# Altium schematic sheet Dash22_LEDS.SchDoc
size A
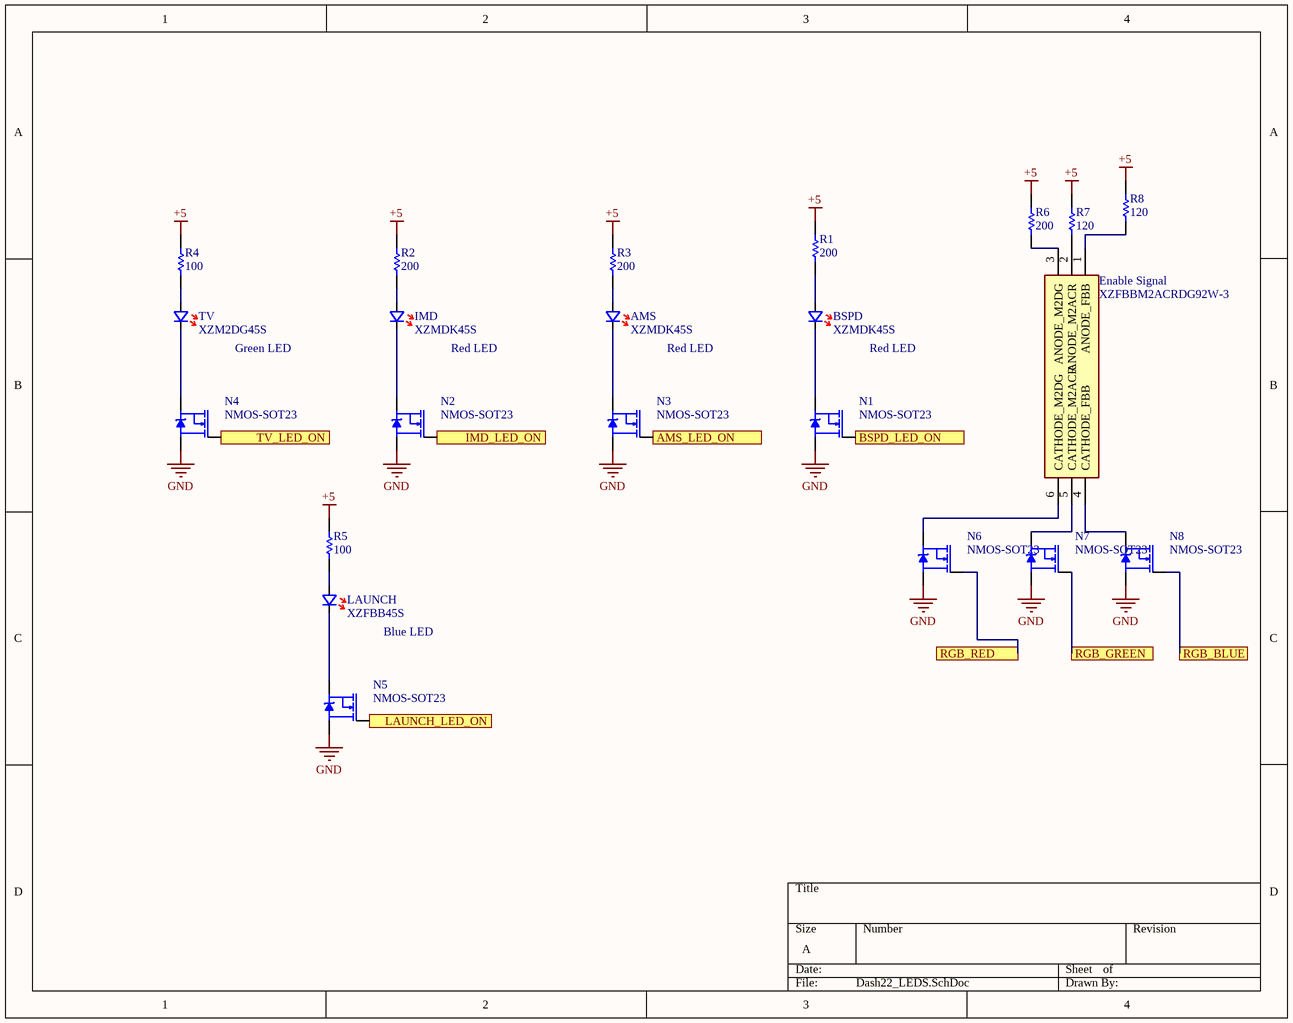
[diagram p0: Dash22_LEDS.SchDoc]

## Parts
AMS  XZMDK45S  [LED_XZFBB45S]
BSPD  XZMDK45S  [LED_XZFBB45S]
Enable_Signal  XZFBBM2ACRDG92W-3  [XZFBBM2ACRDG92W3]
IMD  XZMDK45S  [LED_XZFBB45S]
LAUNCH  XZFBB45S  [LED_XZFBB45S]
N1  NMOS-SOT23  [SOT23]
N2  NMOS-SOT23  [SOT23]
N3  NMOS-SOT23  [SOT23]
N4  NMOS-SOT23  [SOT23]
N5  NMOS-SOT23  [SOT23]
N6  NMOS-SOT23  [SOT23]
N7  NMOS-SOT23  [SOT23]
N8  NMOS-SOT23  [SOT23]
R1  200  [RESC1608X55X25ML10T15]
R2  200  [RESC1608X55X25ML10T15]
R3  200  [RESC1608X55X25ML10T15]
R4  100  [RESC1608X55X25ML10T15]
R5  100  [RESC1608X55X25ML10T15]
R6  200  [RESC1608X55X25ML10T15]
R7  120  [RESC1608X55X25ML10T15]
R8  120  [RESC1608X55X25ML10T15]
TV  XZM2DG45S  [LED_XZFBB45S]

## Ports
AMS_LED_ON, BSPD_LED_ON, IMD_LED_ON, LAUNCH_LED_ON, RGB_BLUE, RGB_GREEN, RGB_RED, TV_LED_ON

## Nets
+5: R1.2 R2.2 R3.2 R4.2 R5.2 R6.2 R7.2 R8.2
GND: N1.2(S) N2.2(S) N3.2(S) N4.2(S) N5.2(S) N6.2(S) N7.2(S) N8.2(S)
AMS_LED_ON: N3.1(G) ; port AMS_LED_ON
BSPD_LED_ON: N1.1(G) ; port BSPD_LED_ON
IMD_LED_ON: N2.1(G) ; port IMD_LED_ON
LAUNCH_LED_ON: N5.1(G) ; port LAUNCH_LED_ON
RGB_BLUE: N8.1(G) ; port RGB_BLUE
RGB_GREEN: N7.1(G) ; port RGB_GREEN
RGB_RED: N6.1(G) ; port RGB_RED
TV_LED_ON: N4.1(G) ; port TV_LED_ON
NetAMS_A: AMS.A R3.1
NetAMS_K: AMS.K N3.3(D)
NetBSPD_A: BSPD.A R1.1
NetBSPD_K: BSPD.K N1.3(D)
NetEnable_Signal_1: Enable_Signal.1(ANODE_FBB) R8.1
NetEnable_Signal_2: Enable_Signal.2(ANODE_M2ACR) R7.1
NetEnable_Signal_3: Enable_Signal.3(ANODE_M2DG) R6.1
NetEnable_Signal_4: Enable_Signal.4(CATHODE_FBB) N8.3(D)
NetEnable_Signal_5: Enable_Signal.5(CATHODE_M2ACR) N7.3(D)
NetEnable_Signal_6: Enable_Signal.6(CATHODE_M2DG) N6.3(D)
NetIMD_A: IMD.A R2.1
NetIMD_K: IMD.K N2.3(D)
NetLAUNCH_A: LAUNCH.A R5.1
NetLAUNCH_K: LAUNCH.K N5.3(D)
NetN4_3: N4.3(D) TV.K
NetR4_1: R4.1 TV.A

## Notes on the sheet
- Green LED
- Red LED
- Blue LED

## Library data of the parts
AMS BSPD IMD LAUNCH TV = CMP-009-000234-1: Design Item ID: LED_XZFBB45S; Source: ife19_Elec_Library.schlib
Enable_Signal = XZFBBM2ACRDG92W-3: LED; Manufacturer_Name: SunLED; Datasheet Link: https://www.sunledusa.com/products/spec/XZFBBM2ACRDG92W-3.pdf; Height: 1.25mm; Manufacturer_Part_Number: XZFBBM2ACRDG92W-3
N1-N8 = CMP-009-000226-1: Source: ife19_Elec_Library.schlib; Design Item ID: NMOS-SOT23
R1-R8 = CMP-009-000010-1: Chip Resistor, 0 Ohm, 0.1 W, -55 to 155 degC, 0603 (1608 Metric); Source: Integrated_Library - 12.03.21 - 15.39.SchLib; Design Item ID: CMP-009-00006-4